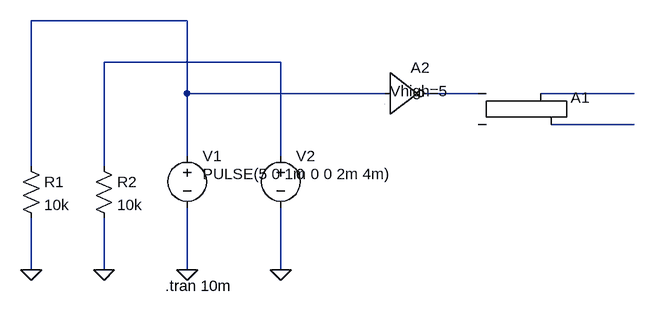
[diagram p0: schematic Draft1.asc]
Draft1.asc, the LTspice schematic file:
Version 4
SHEET 1 880 680
WIRE -160 64 -400 64
WIRE -16 128 -288 128
WIRE -160 176 -160 64
WIRE 144 176 -160 176
WIRE 288 176 208 176
WIRE 528 176 384 176
WIRE 528 224 400 224
WIRE -160 272 -160 176
WIRE -16 272 -16 128
WIRE -400 288 -400 64
WIRE -288 288 -288 128
WIRE -400 448 -400 368
WIRE -288 448 -288 368
WIRE -160 448 -160 352
WIRE -16 448 -16 352
FLAG -16 448 0
FLAG -160 448 0
FLAG -288 448 0
FLAG -400 448 0
SYMBOL Digital\\srflop 336 128 R0
WINDOW 3 0 0 Invisible 2
SYMATTR InstName A1
SYMATTR Value Vhigh=5
SYMBOL voltage -160 256 R0
WINDOW 3 24 44 Left 2
WINDOW 123 0 0 Left 2
WINDOW 39 0 0 Left 2
SYMATTR InstName V1
SYMATTR Value PULSE(5 0 1m 0 0 2m 4m)
SYMBOL voltage -16 256 R0
WINDOW 3 24 44 Left 2
WINDOW 123 0 0 Left 2
WINDOW 39 0 0 Left 2
SYMATTR InstName V2
SYMATTR Value 0
SYMBOL res -416 272 R0
SYMATTR InstName R1
SYMATTR Value 10k
SYMBOL res -304 272 R0
SYMATTR InstName R2
SYMATTR Value 10k
SYMBOL Digital\\inv 144 112 R0
WINDOW 3 8 60 Left 2
SYMATTR InstName A2
SYMATTR Value Vhigh=5
TEXT -194 472 Left 2 !.tran 10m

The netlist it stands for:
* Draft1.asc
A1 N003 0 0 0 0 N005 N004 0 SRFLOP Vhigh=5
V1 N001 0 PULSE(5 0 1m 0 0 2m 4m)
V2 N002 0 0
R1 N001 0 10k
R2 N002 0 10k
A2 N001 0 0 0 0 N003 0 0 BUF Vhigh=5
.tran 10m
.backanno
.end